# Altium project usomiq-audio-cape.PrjPcb
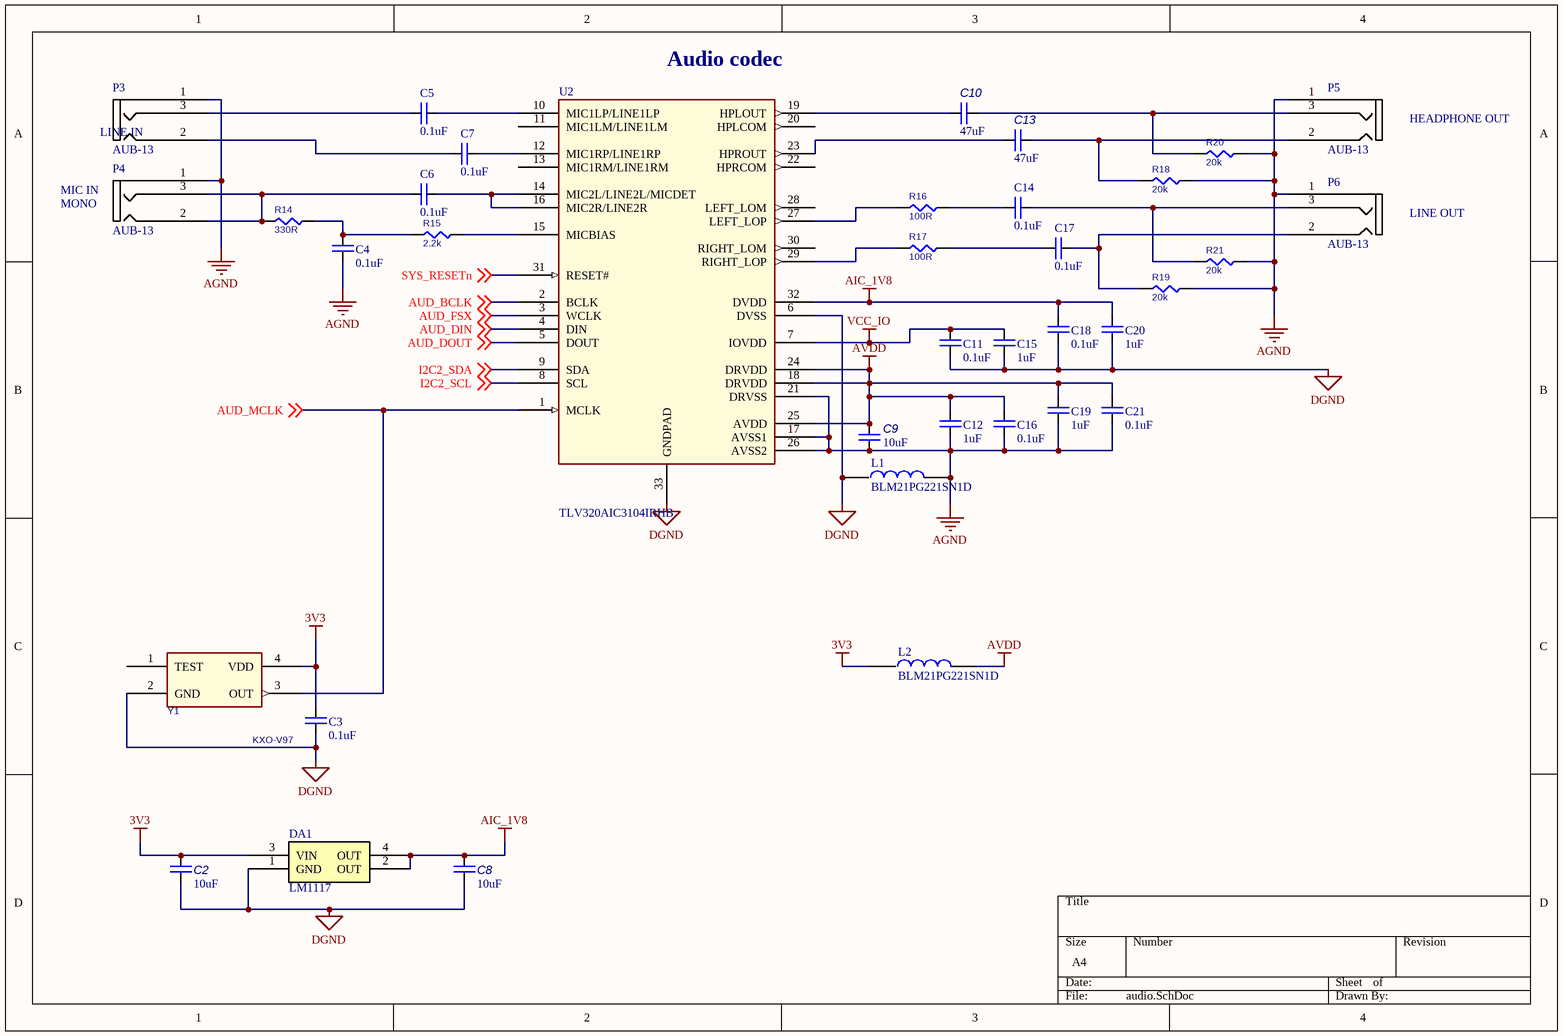
[diagram p0: audio.SchDoc]
2 sheets, 57 parts. Net scope: global (net labels, ports and power ports of the same name join across sheets).
Board file: usomiq-audio-cape.PcbDoc
Sheets:
  audio.SchDoc
  bone_capes.SchDoc

## Sheet audio.SchDoc
size A4

### Parts
C2  value 10uF  [CC2012-0805]  (hidden comment: C0805)
C3  value 0.1uF  [CHIP0603]  (hidden comment: C0603)
C4  value 0.1uF  [CHIP0603]  (hidden comment: C0603)
C5  value 0.1uF  [CHIP0603]  (hidden comment: C0603)
C6  value 0.1uF  [CHIP0603]  (hidden comment: C0603)
C7  value 0.1uF  [CHIP0603]  (hidden comment: C0603)
C8  value 10uF  [CC2012-0805]  (hidden comment: C0805)
C9  value 10uF  [CC2012-0805]  (hidden comment: C0805)
C10  value 47uF  [CC3216-1206]  (hidden comment: C1206)
C11  value 0.1uF  [CHIP0603]  (hidden comment: C0603)
C12  value 1uF  [CHIP0603]  (hidden comment: C0603)
C13  value 47uF  [CC3216-1206]  (hidden comment: C1206)
C14  value 0.1uF  [CHIP0603]  (hidden comment: C0603)
C15  value 1uF  [CHIP0603]  (hidden comment: C0603)
C16  value 0.1uF  [CHIP0603]  (hidden comment: C0603)
C17  value 0.1uF  [CHIP0603]  (hidden comment: C0603)
C18  value 0.1uF  [CHIP0603]  (hidden comment: C0603)
C19  value 1uF  [CHIP0603]  (hidden comment: C0603)
C20  value 1uF  [CHIP0603]  (hidden comment: C0603)
C21  value 0.1uF  [CHIP0603]  (hidden comment: C0603)
DA1  LM1117  [SOT230P700X160-4N]
L1  BLM21PG221SN1D  [Chip2PinSM127P600-8N]
L2  BLM21PG221SN1D  [Chip2PinSM127P600-8N]
P3  AUB-13  [AUB_13]
P4  AUB-13  [AUB_13]
P5  AUB-13  [AUB_13]
P6  AUB-13  [AUB_13]
R14  value 330R  [CHIP0603]  (hidden comment: R0603)
R15  value 2.2k  [CHIP0603]  (hidden comment: R0603)
R16  value 100R  [CHIP0603]  (hidden comment: R0603)
R17  value 100R  [CHIP0603]  (hidden comment: R0603)
R18  value 20k  [CHIP0603]  (hidden comment: R0603)
R19  value 20k  [CHIP0603]  (hidden comment: R0603)
R20  value 20k  [CHIP0603]  (hidden comment: R0603)
R21  value 20k  [CHIP0603]  (hidden comment: R0603)
U2  Man P/N: TLV320AIC3104IRHB  [QFN32]  (hidden comment: TLV320AIC3104)
Y1  KXO-V97  [KXO_V97]

### Nets
3V3: C2.2 C3.1 DA1.3(VIN) L2.1 Y1.4(VDD)
AGND: C4.1 C9.1 C12.2 C16.2 C19.2 C21.2 L1.2 P3.1(GND) P4.1(GND) P5.1(GND) P6.1(GND) R18.1 R19.1 R20.1 R21.1 U2.17(AVSS1) U2.21(DRVSS) U2.26(AVSS2)
AIC_1V8: C8.2 C18.1 C20.1 DA1.2(OUT) DA1.4(OUT) U2.32(DVDD)
AVDD: C9.2 C12.1 C16.1 C19.1 C21.1 L2.2 U2.18(DRVDD) U2.24(DRVDD) U2.25(AVDD)
DGND: C2.1 C3.2 C8.1 C11.2 C15.2 C18.2 C20.2 DA1.1(GND) L1.1 U2.6(DVSS) U2.33(GNDPAD) Y1.2(GND)
VCC_IO: C11.1 C15.1 U2.7(IOVDD)
AUD_BCLK: U2.2(BCLK) ; off-sheet AUD_BCLK
AUD_DIN: U2.4(DIN) ; off-sheet AUD_DIN
AUD_DOUT: U2.5(DOUT) ; off-sheet AUD_DOUT
AUD_FSX: U2.3(WCLK) ; off-sheet AUD_FSX
AUD_MCLK: U2.1(MCLK) Y1.3(OUT) ; off-sheet AUD_MCLK
I2C2_SCL: U2.8(SCL) ; off-sheet I2C2_SCL
I2C2_SDA: U2.9(SDA) ; off-sheet I2C2_SDA
SYS_RESETn: U2.31(RESET#) ; off-sheet SYS_RESETn
NetC4_2: C4.2 R14.2 R15.1
NetC5_1: C5.1 P3.3(LEFT)
NetC5_2: C5.2 U2.10(MIC1LP/LINE1LP)
NetC6_1: C6.1 P4.2(RIGHT) P4.3(LEFT) R14.1
NetC6_2: C6.2 U2.14(MIC2L/LINE2L/MICDET) U2.16(MIC2R/LINE2R)
NetC7_1: C7.1 P3.2(RIGHT)
NetC7_2: C7.2 U2.12(MIC1RP/LINE1RP)
NetC10_1: C10.1 P5.3(LEFT) R20.2
NetC10_2: C10.2 U2.19(HPLOUT)
NetC13_1: C13.1 P5.2(RIGHT) R18.2
NetC13_2: C13.2 U2.23(HPROUT)
NetC14_1: C14.1 R16.2
NetC14_2: C14.2 P6.3(LEFT) R21.2
NetC17_1: C17.1 R17.2
NetC17_2: C17.2 P6.2(RIGHT) R19.2
NetR15_2: R15.2 U2.15(MICBIAS)
NetR16_1: R16.1 U2.27(LEFT_LOP)
NetR17_1: R17.1 U2.29(RIGHT_LOP)

Not connected (* = marked no-connect by the designer): U2 11(MIC1LM/LINE1LM) 13(MIC1RM/LINE1RM) 20(HPLCOM) 22(HPRCOM) 28(LEFT_LOM) 30(RIGHT_LOM); Y1 1(TEST)

### Notes on the sheet
- (near U2) Audio codec
- LINE IN
- HEADPHONE OUT
- MIC IN
  MONO
- LINE OUT

### Library data of the parts
C3-C7 C11 C12 C14-C21 = C0603: Ceramic capacitor C0603
DA1 = LM1117: 800mA Low-Dropout Linear Regulator; Manufacturer: National; Man P/N: LM1117IMPX-3.3; Package: 3-lead  SOT-223
L1 L2 = BLM21PG221SN1D: Manufacturer: Murata; Man P/N: MMZ1608R301A
P3-P6 = AUB-13: Audio connector mini-jack 3.5mm, 3 pins; Vendor: brownbear.ru
R14-R21 = R0603: Resistor 0603
U2 = TLV320AIC3104: LOW-POWER STEREO AUDIO CODEC FOR PORTABLE AUDIO/TELEPHONY; Manufacturer: TI
Y1 = KXO-V97: Quartz oscillator 7x5mm; Manufacturer: Geyer; Value: *; Man P/N: KXO-V97
C2 C8 C9 = C0805: P/N: *
C10 C13 = C1206: P/N: *

## Sheet bone_capes.SchDoc
size A4
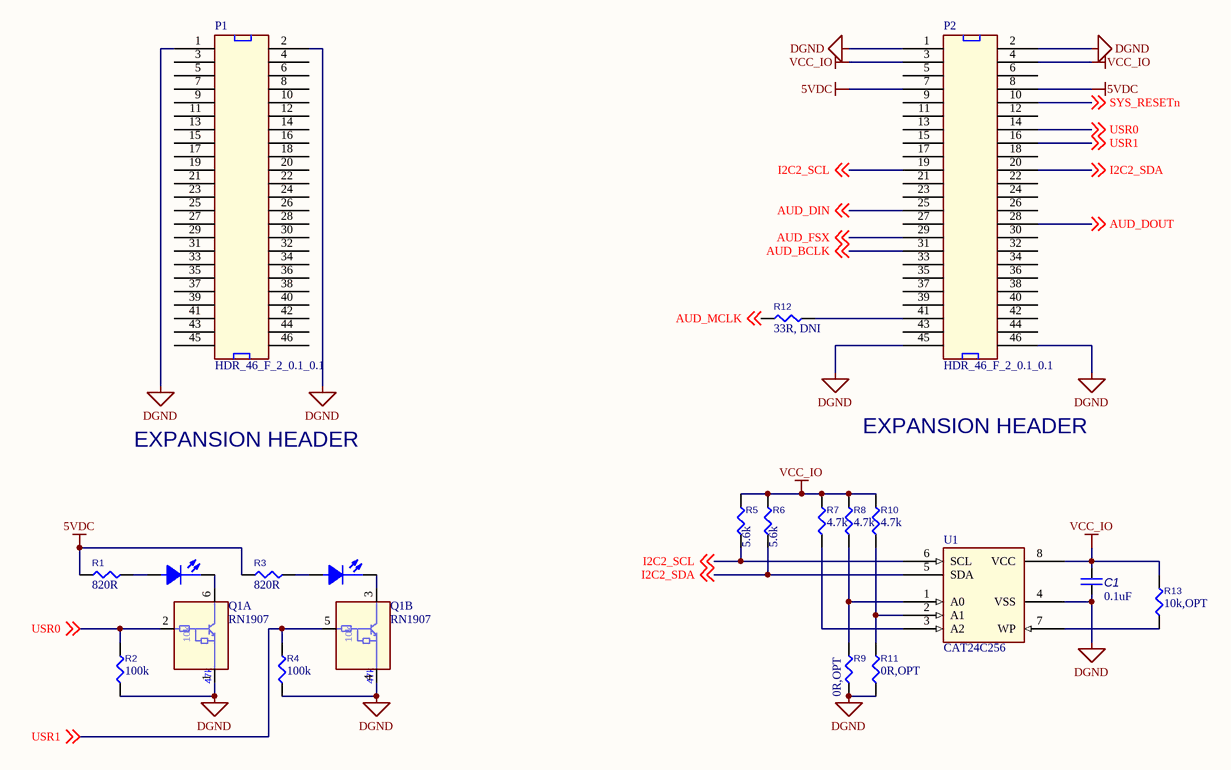
[diagram p1: bone_capes.SchDoc]

### Parts
C1  value 0.1uF  [CC1608-0603]  (hidden comment: C0603)
D1  LED0805  [LED0805]  (value not drawn)
D2  LED0805  [LED0805]  (value not drawn)
P1  HDR_46_F_2_0.1_0.1  [DIP46]
P2  HDR_46_F_2_0.1_0.1  [DIP46]
Q1  RN1907  [SOT363-6L]  (parts A,B of 2)
R1  value 820R  [RESC1608X55N]  (hidden comment: R0603)
R2  value 100k  [RESC1608X55N]  (hidden comment: R0603)
R3  value 820R  [RESC1608X55N]  (hidden comment: R0603)
R4  value 100k  [RESC1608X55N]  (hidden comment: R0603)
R5  value 5.6k  [RESC1608X55N]  (hidden comment: R0603)
R6  value 5.6k  [RESC1608X55N]  (hidden comment: R0603)
R7  value 4.7k  [RESC1608X55N]  (hidden comment: R0603)
R8  value 4.7k  [RESC1608X55N]  (hidden comment: R0603)
R9  value 0R,OPT  [RESC1608X55N]  (hidden comment: R0603)
R10  value 4.7k  [RESC1608X55N]  (hidden comment: R0603)
R11  value 0R,OPT  [RESC1608X55N]  (hidden comment: R0603)
R12  value 33R, DNI  [RESC1608X55N]  (hidden comment: R0603)
R13  value 10k,OPT  [RESC1608X55N]  (hidden comment: R0603)
U1  CAT24C256  [SOIC127P600X173-8L]

### Nets
5VDC: P2.7 P2.8 R1.2 R3.2
DGND: C1.2 P1.1 P1.2 P2.1 P2.2 P2.45 P2.46 Q1.1 Q1.4 R2.1 R4.1 R9.1 R11.1 U1.4(VSS)
VCC_IO: C1.1 P2.3 P2.4 R5.2 R6.2 R7.2 R8.2 R10.2 R13.2 U1.8(VCC)
AUD_BCLK: P2.31 ; off-sheet AUD_BCLK
AUD_DIN: P2.25 ; off-sheet AUD_DIN
AUD_DOUT: P2.28 ; off-sheet AUD_DOUT
AUD_FSX: P2.29 ; off-sheet AUD_FSX
AUD_MCLK: R12.1 ; off-sheet AUD_MCLK
I2C2_SCL: P2.19 R5.1 U1.6(SCL) ; off-sheet I2C2_SCL
I2C2_SDA: P2.20 R6.1 U1.5(SDA) ; off-sheet I2C2_SDA
SYS_RESETn: P2.10 ; off-sheet SYS_RESETn
USR0: P2.14 Q1.2 R2.2 ; off-sheet USR0
USR1: P2.16 Q1.5 R4.2 ; off-sheet USR1
NetD1_1: D1.1(A) R1.1
NetD1_2: D1.2(C) Q1.6
NetD2_1: D2.1(A) R3.1
NetD2_2: D2.2(C) Q1.3
NetP2_41: P2.41 R12.2
NetR7_1: R7.1 U1.3(A2)
NetR8_1: R8.1 R9.2 U1.1(A0)
NetR10_1: R10.1 R11.2 U1.2(A1)
NetR13_1: R13.1 U1.7(WP)

Not connected (* = marked no-connect by the designer): P1 3(2) 4(27) 5(3) 6(28) 7(4) 8(29) 9(5) 10(30) 11(6) 12(31) 13(7) 14(32) 15(8) 16(33) 17(9) 18(34) 19(10) 20(35) 21(11) 22(36) 23(12) 24(37) 25(13) 26(38) 27(14) 28(39) 29(15) 30(40) 31(16) 32(41) 33(17) 34(42) 35(18) 36(43) 37(19) 38(44) 39(20) 40(45) 41(21) 42(46) 43(22) 44(47) 45(23) 46(48); P2 5(3) 6(28) 9(5) 11(6) 12(31) 13(7) 15(8) 17(9) 18(34) 21(11) 22(36) 23(12) 24(37) 26(38) 27(14) 30(40) 32(41) 33(17) 34(42) 35(18) 36(43) 37(19) 38(44) 39(20) 40(45) 42(46) 43(22) 44(47)

### Notes on the sheet
- EXPANSION HEADER

### Library data of the parts
D1 D2 = LED0805: LED 0805; Value: *
P1 P2 = HDR_46_F_2_0.1_0.1: NN HEADER FMAL 46PS.1" DL GOLD; Mfr: major league electronics; P/N: SSHS-123-D-02-GT-LF
Q1 = RN1907: Transistor Silicon NPN; Mfr: Panasonic; P/N: DMC564040R
U1 = CAT24C256: 256 kb I2C CMOS Serial  EEPROM; Manufacturer: ON Semiconductor; Man P/N: CAT24C256WI-GT3
C1 = C0603: P/N: *
R1-R13 = R0603: P/N: *

## Nets that join several sheets
DGND: audio (12 pins), bone_capes (14 pins)
VCC_IO: audio (C11.1 C15.1 U2.7), bone_capes (10 pins)
AUD_BCLK: audio (U2.2), bone_capes (P2.31)
AUD_DIN: audio (U2.4), bone_capes (P2.25)
AUD_DOUT: audio (U2.5), bone_capes (P2.28)
AUD_FSX: audio (U2.3), bone_capes (P2.29)
AUD_MCLK: audio (U2.1 Y1.3), bone_capes (R12.1)
I2C2_SCL: audio (U2.8), bone_capes (P2.19 R5.1 U1.6)
I2C2_SDA: audio (U2.9), bone_capes (P2.20 R6.1 U1.5)
SYS_RESETn: audio (U2.31), bone_capes (P2.10)